# EAGLE design JMP_1_1 (EAGLE 8.3.2)
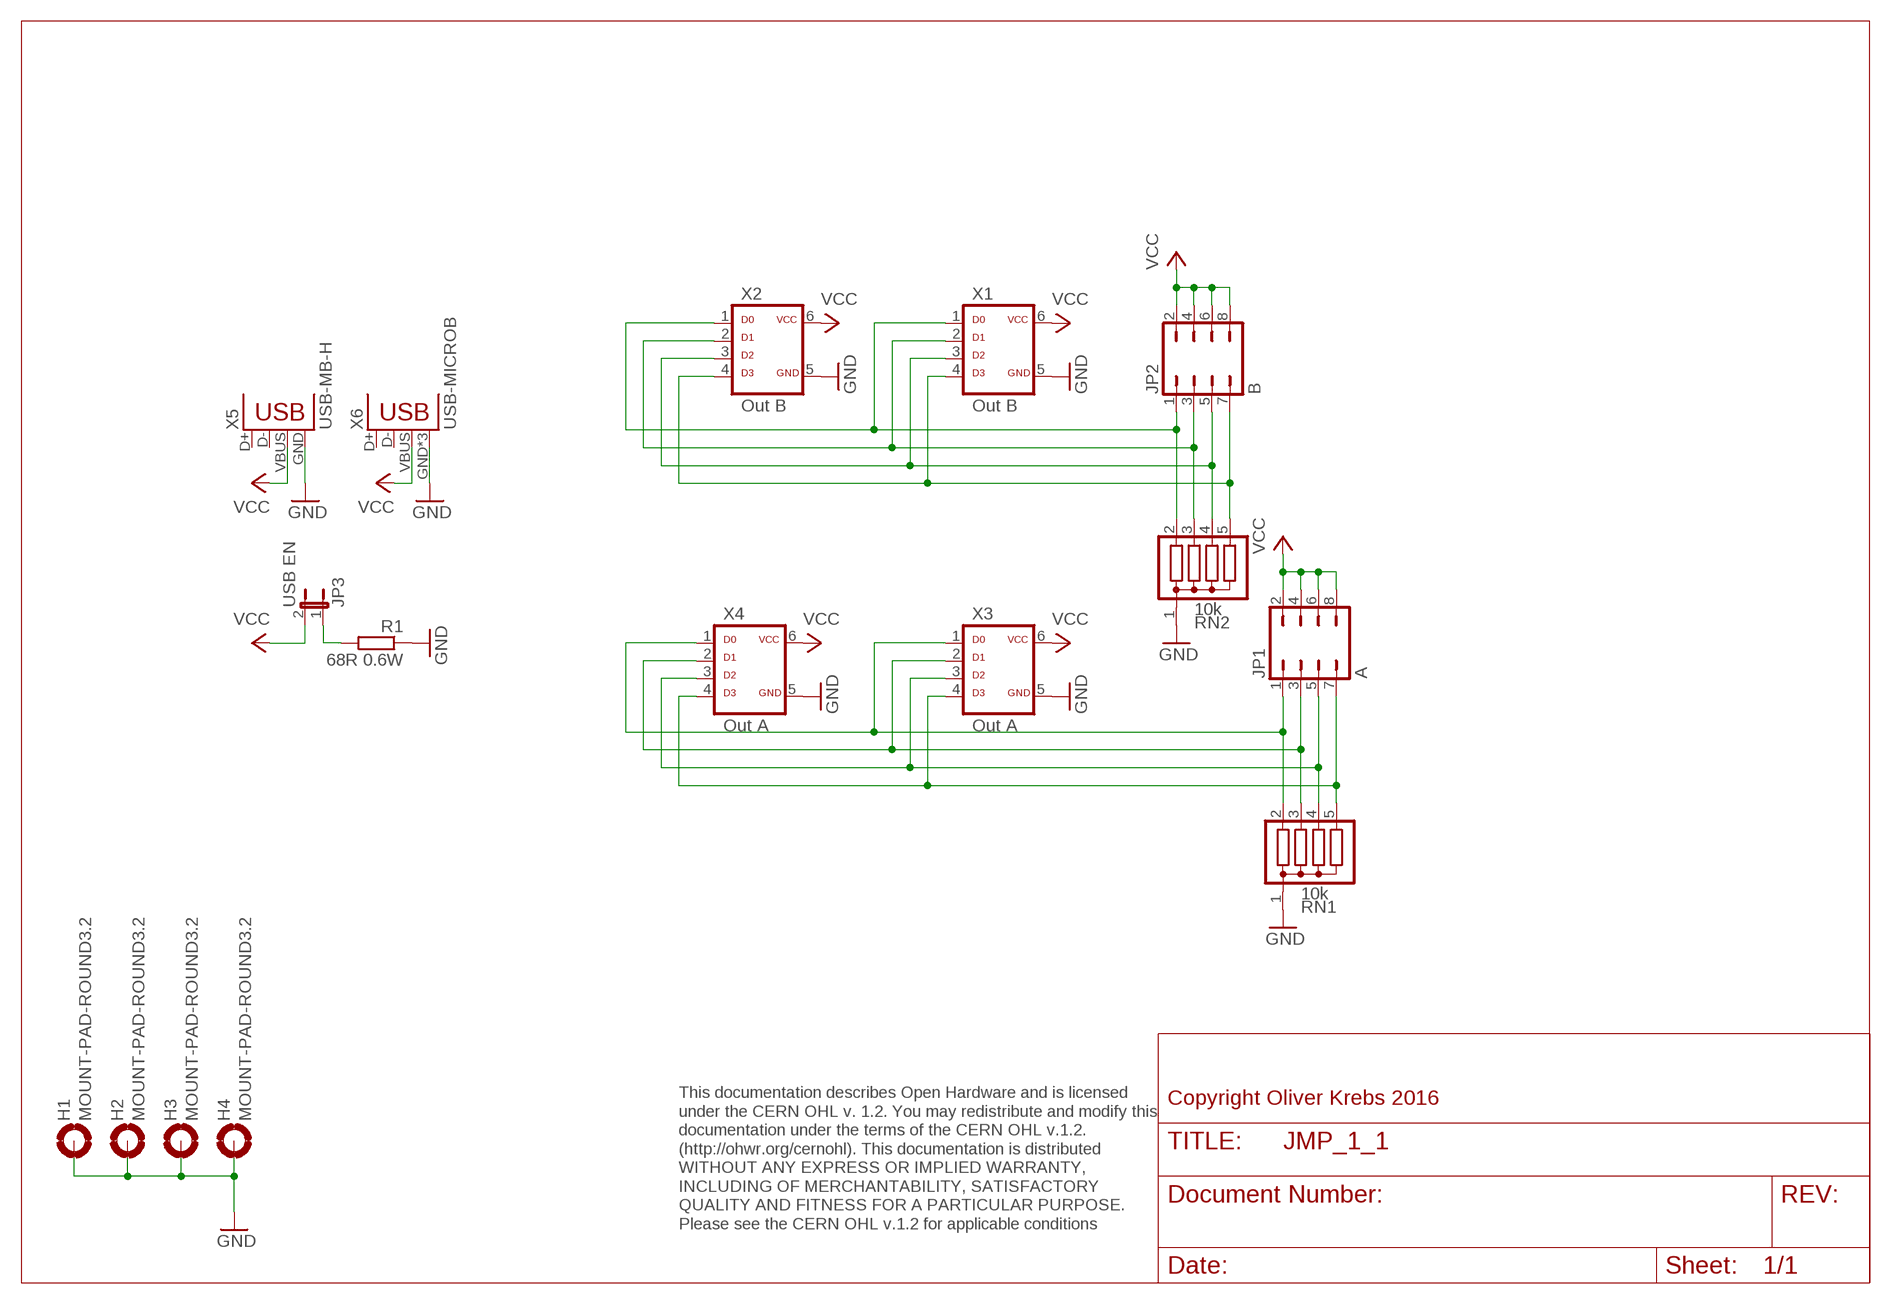
[diagram p0: schematic, sheet 1]

## Parts
H1  MOUNT-PAD-ROUND3.2  [3,2-PAD]
H2  MOUNT-PAD-ROUND3.2  [3,2-PAD]
H3  MOUNT-PAD-ROUND3.2  [3,2-PAD]
H4  MOUNT-PAD-ROUND3.2  [3,2-PAD]
JP1  A  JP4Q  [JP4Q]
JP2  B  JP4Q  [JP4Q]
JP3  USB EN  JP1E  [JP1]
R1  68R 0.6W  R-EU_0207/10  [0207/10]
RN1  10k  G04R  [SIL5]
RN2  10k  G04R  [SIL5]
X1  Out B  ML6D  [ML-6]
X2  Out B  ML6D  [ML-6]
X3  Out A  ML6D  [ML-6]
X4  Out A  ML6D  [ML-6]
X5  USB-MB-H  [USB-MB-H]
X6  USB-MICROB  [USB-MICROB]

## Nets
GND: H1.B3,2(MOUNT) H2.B3,2(MOUNT) H3.B3,2(MOUNT) H4.B3,2(MOUNT) R1.1 RN1.1 RN2.1 X1.5 X2.5 X3.5 X4.5 X5.GND X6.GND X6.MT1(GND) X6.MT2(GND)
N$1: JP2.1 RN2.2 X1.1 X2.1
N$2: JP2.3 RN2.3 X1.2 X2.2
N$3: JP1.1 RN1.2 X3.1 X4.1
N$4: JP2.7 RN2.5 X1.4 X2.4
N$5: JP1.3 RN1.3 X3.2 X4.2
N$6: JP1.7 RN1.5 X3.4 X4.4
N$7: JP2.5 RN2.4 X1.3 X2.3
N$8: JP1.5 RN1.4 X3.3 X4.3
N$10: JP3.1 R1.2
VCC: JP1.2 JP1.4 JP1.6 JP1.8 JP2.2 JP2.4 JP2.6 JP2.8 JP3.2 X1.6 X2.6 X3.6 X4.6 X5.VBUS X6.VBUS
Unconnected: X5.D+ X5.D- X6.D+ X6.D-

## Notes on the sheet
- Copyright Oliver Krebs 2016
- This documentation describes Open Hardware and is licensed 
  under the CERN OHL v. 1.2. You may redistribute and modify this 
  documentation under the terms of the CERN OHL v.1.2. 
  (http://ohwr.org/cernohl). This documentation is distributed
  WITHOUT ANY EXPRESS OR IMPLIED WARRANTY, 
  INCLUDING OF MERCHANTABILITY, SATISFACTORY 
  QUALITY AND FITNESS FOR A PARTICULAR PURPOSE. 
  Please see the CERN OHL v.1.2 for applicable conditions

## Library data of the parts
H1-H4 = holes:MOUNT-PAD-ROUND: MOUNTING PAD, round
JP1 JP2 = 01-my-con:JP4Q
JP3 = jumper:JP1E: JUMPER
R1 = 01-my_rcl:R-EU_: RESISTOR, European symbol
RN1 RN2 = resistor-sil:G04R: SIL RESISTOR; OC_FARNELL: unknown; OC_NEWARK: unknown
X1-X4 = 01-my-con:ML6D
X5 = SparkFun-Connectors:USB: USB Connectors USB-B-PTH is fully proven SKU : PRT-00139/CONN-08278 USB-miniB is fully proven SKU : PRT-00587 USB-A-PCB is untested. USB-A-H is throughly reviewed, but untested. Spark Fun Electronics SKU : PRT-00437 USB-B-SMT is throughly reviewed, but untested. Needs silkscreen touching up. USB-A-S has not been used/tested USB-MB-H has not been used/tested USB-MICROB has been used. CONN-09505
X6 = SparkFun-Connectors:USB: USB Connectors USB-B-PTH is fully proven SKU : PRT-00139/CONN-08278 USB-miniB is fully proven SKU : PRT-00587 USB-A-PCB is untested. USB-A-H is throughly reviewed, but untested. Spark Fun Electronics SKU : PRT-00437 USB-B-SMT is throughly reviewed, but untested. Needs silkscreen touching up. USB-A-S has not been used/tested USB-MB-H has not been used/tested USB-MICROB has been used. CONN-09505; PROD_ID: CONN-09505

## Board
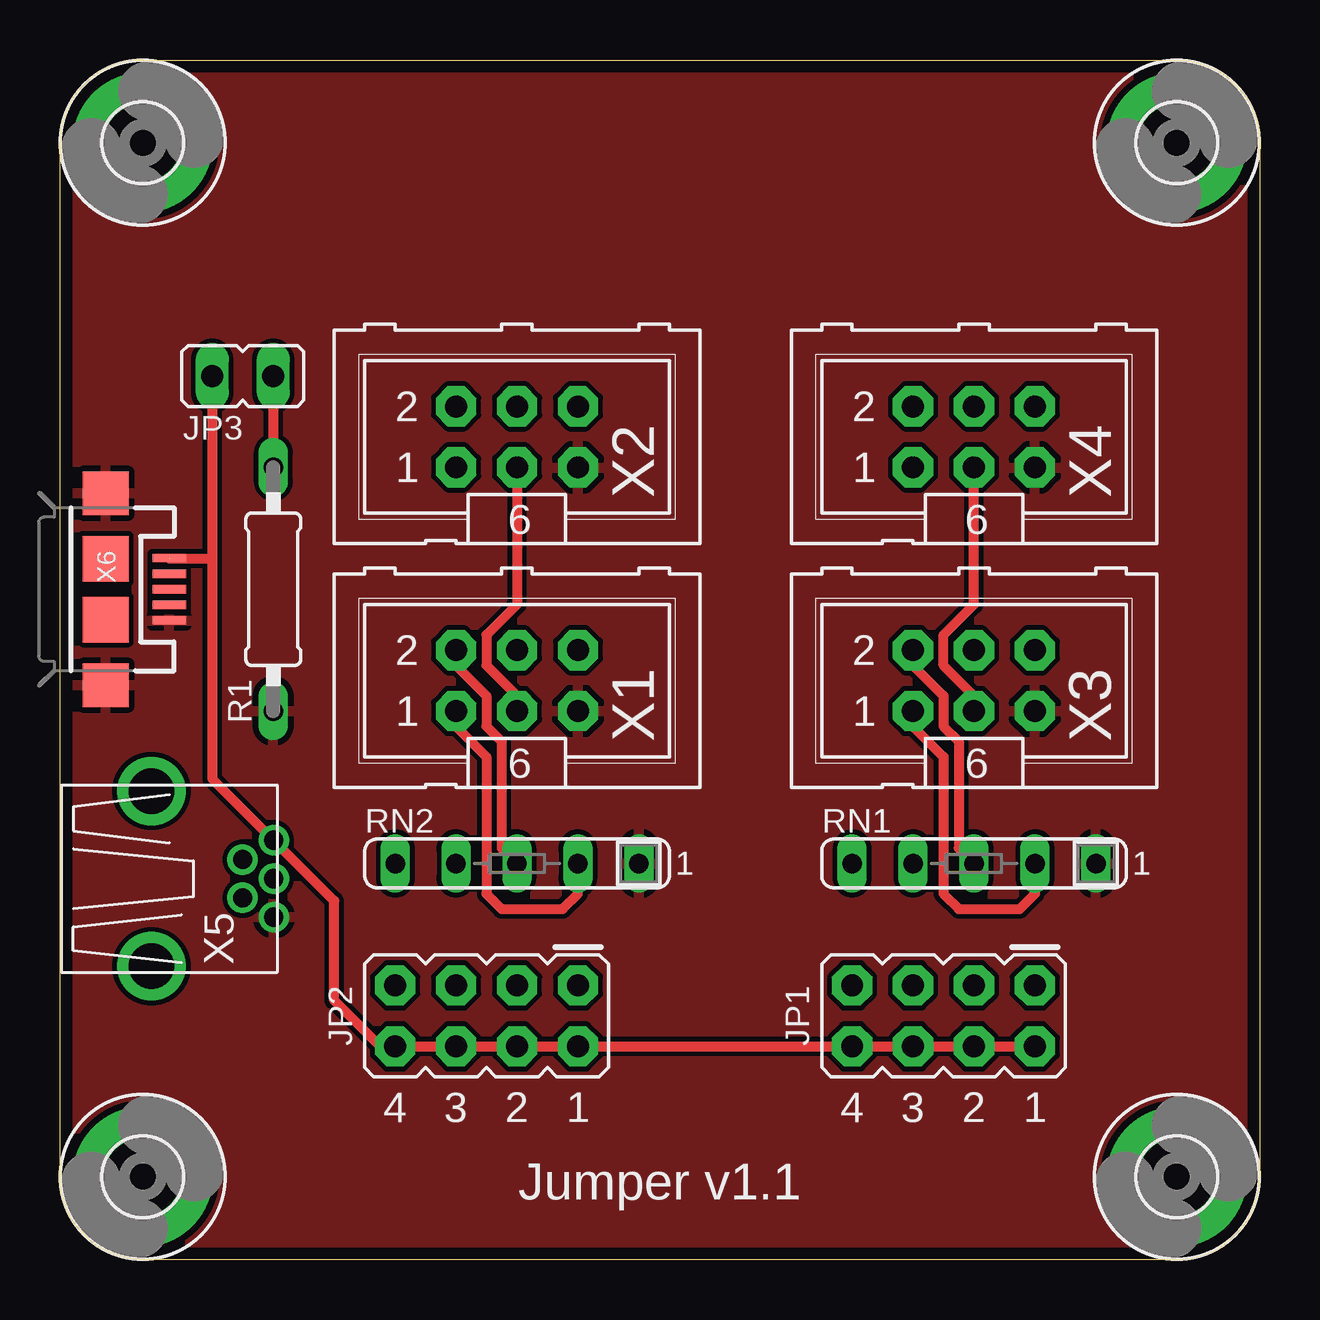
[diagram p1: board, top side]
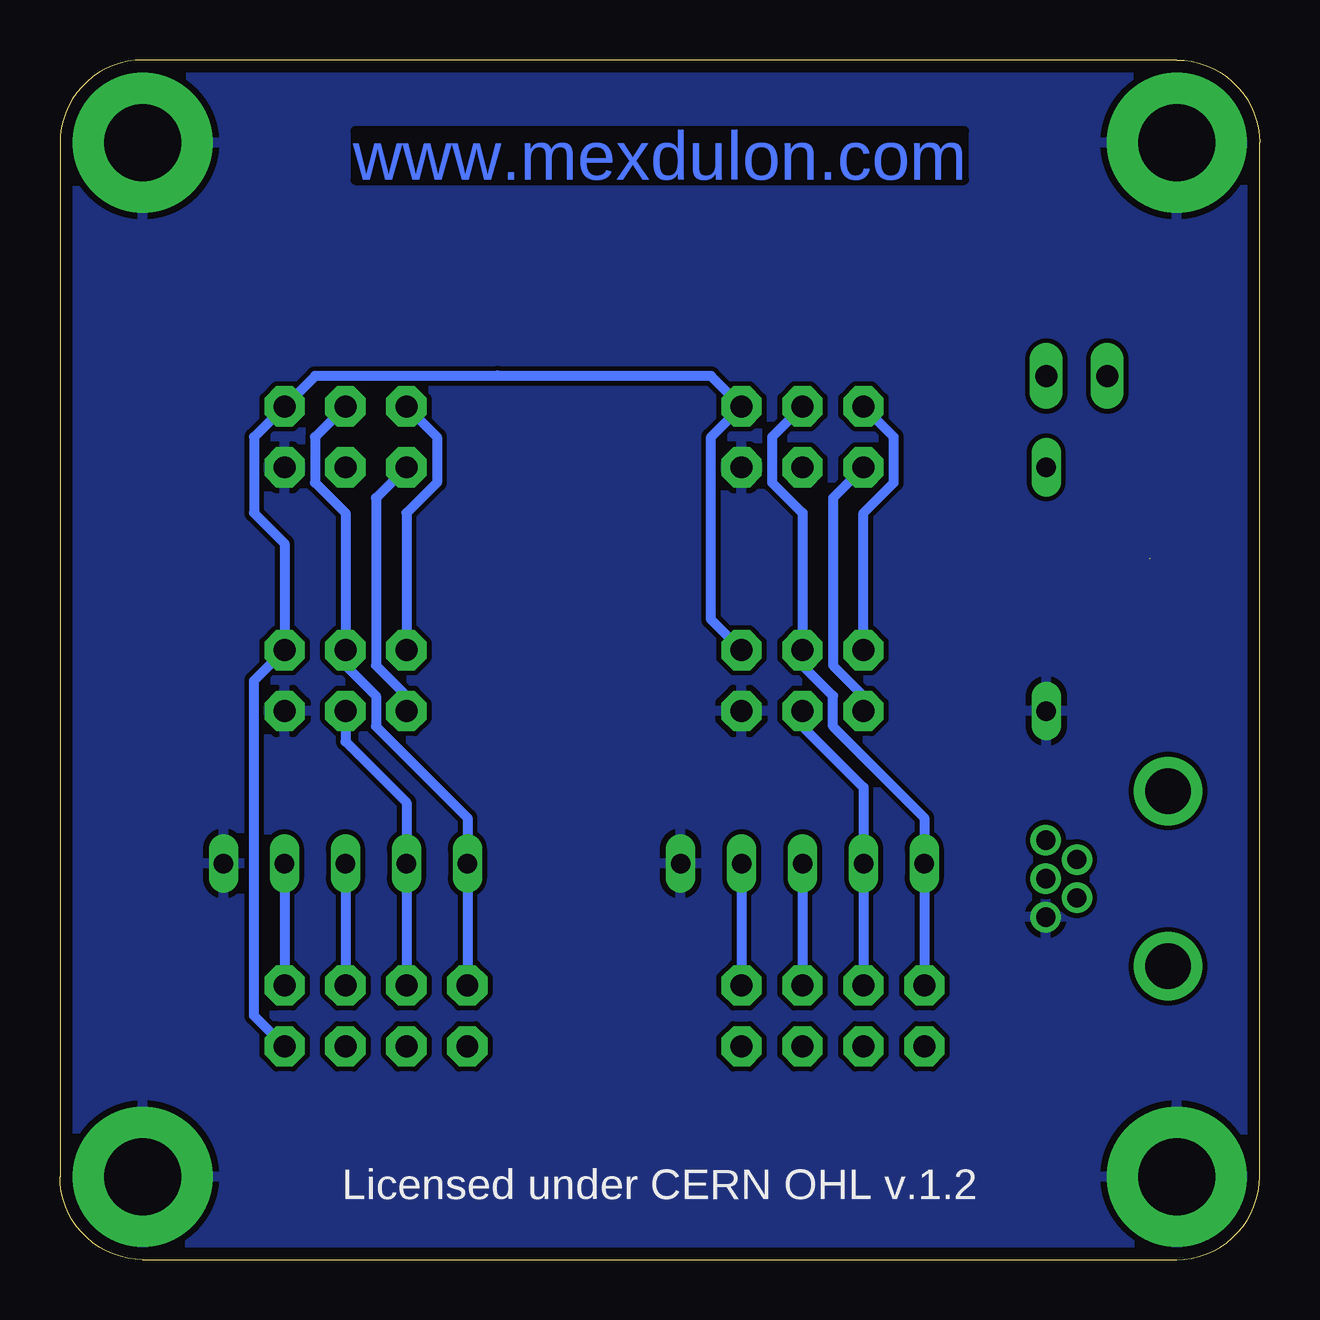
[diagram p2: board, bottom side, seen from below]

Size 50 x 50 mm. Coordinates in mm from the lower left corner, seen from the top.
Outline: 0,3.45 0,46.55 arc-90 3.45,50 46.55,50 arc-90 50,46.55 50,3.45 arc-90 46.55,0 3.45,0 arc-90 0,3.45
Copper layers (1*16): Top 0.035mm / dielectric 1.6mm / Bottom 0.035mm
Design rules "Elecrow_2-layer_PCB_eagle_rule": minimum track width 6mil, minimum drill 12mil, track to track 6mil, track to pad 6mil, pad to pad 6mil, via to via 8mil, smd to smd 0mil, copper to edge 20mil, drill to drill 10mil, minimum pad ring 6mil, minimum via ring 6mil, stop-mask expansion 0mil, vias tented up to drill 100mil, thermal gap 10mil

### Footprints (pad centres in the part's own frame; a part is rotated, then mirrored left to right if it is on the bottom)
3,2-PAD = drill 3.2 pad 5.842: B3,2 0,0
JP4Q = drill 0.914 pad 1.676 octagon: 1 -3.81,-1.27; 2 -3.81,1.27; 3 -1.27,-1.27; 4 -1.27,1.27; 5 1.27,-1.27; 6 1.27,1.27; 7 3.81,-1.27; 8 3.81,1.27
JP1 = drill 0.914 long: 1 0,-1.27; 2 0,1.27
0207/10 = drill 0.813 long: 1 -5.08,0; 2 5.08,0
SIL5 = drill 0.813 long: 1 -5.08,0; 2 -2.54,0; 3 0,0; 4 2.54,0; 5 5.08,0
ML-6 = drill 0.914 pad 1.676 octagon: 1 -2.54,-1.27; 2 -2.54,1.27; 3 0,-1.27; 4 0,1.27; 5 2.54,-1.27; 6 2.54,1.27
USB-MB-H = drill 0.8 pad 1.27: D+ 5.1,0; D- 3.8,0.8; GND 5.1,-1.6; ID 3.8,-0.8; VBUS 5.1,1.6 | drill 1.9: P$6 0,-3.65; P$7 0,3.65
USB-MICROB = smd 0.35 x 1.4: D+ 0,2.65; D- -0.65,2.65; GND 1.3,2.65; ID 0.65,2.65; VBUS -1.3,2.65 | smd 1.8 x 1.9: MT1 -4,0; MT2 4,0 | smd 1.9 x 1.9: P$1 -1.27,0; P$2 1.27,0

### Placement (x,y rotation side)
H1  3.45,3.45 0 top
H2  3.45,46.55 0 top
H3  46.55,46.55 0 top
H4  46.55,3.45 0 top
JP1  36.83,10.16 180 top
JP2  17.78,10.16 180 top
JP3  7.62,36.83 90 top
R1  8.89,27.94 90 top
RN1  38.1,16.51 180 top
RN2  19.05,16.51 180 top
X1  19.05,24.13 0 top
X2  19.05,34.29 0 top
X3  38.1,24.13 0 top
X4  38.1,34.29 0 top
X5  3.81,15.88 0 top
X6  1.91,27.94 270 top

### Tracks (layer width: path | path; a pad name or v marks a point on that pad's centre or on a via)
GND
  pour Bottom (isolate 0.203): 0,0 50.16,0 50.16,50.16 0,50.16
  pour Top (isolate 0.203): 0,50.16 50.16,50.16 50.16,0 0,0
N$1
  Top 0.406: X1.1 16.51,22.23 17.78,20.95 17.78,15.24 18.41,14.61 20.95,14.61 21.59,15.24 RN2.2
  Bottom 0.406: RN2.2 JP2.1 | X2.1 17.78,31.75 17.78,24.77 16.51,23.5 X1.1
N$2
  Top 0.406: X1.2 16.51,24.77 17.78,23.5 17.78,22.23 18.41,21.59 18.41,17.14 RN2.3
  Bottom 0.406: RN2.3 JP2.3 | X1.2 16.51,31.11 15.24,32.38 15.24,34.29 X2.2
N$3
  Top 0.406: X3.1 35.56,22.23 36.83,20.95 36.83,15.24 37.47,14.61 40.01,14.61 40.64,15.24 RN1.2
  Bottom 0.406: RN1.2 JP1.1 | X4.1 36.83,31.75 36.83,24.77 35.56,23.5 X3.1
N$4
  Bottom 0.406: JP2.7 RN2.5 13.97,18.41 17.78,22.23 17.78,23.5 19.05,24.77 X1.4 19.05,31.11 20.32,32.38 20.32,34.29 X2.4
N$5
  Top 0.406: X3.2 35.56,24.77 36.83,23.5 36.83,22.23 37.47,21.59 37.47,17.14 RN1.3
  Bottom 0.406: RN1.3 JP1.3 | X4.2 34.29,34.29 34.29,32.38 35.56,31.11 X3.2
N$6
  Bottom 0.406: JP1.7 RN1.5 33.02,18.41 36.83,22.23 36.83,23.5 38.1,24.77 X3.4 38.1,31.11 39.37,32.38 39.37,34.29 X4.4
N$7
  Top 0.406: X2.3 19.05,27.3 17.78,26.04 17.78,24.77 19.05,23.5 X1.3
  Bottom 0.406: JP2.5 RN2.4 16.51,19.68 19.05,22.23 X1.3
N$8
  Top 0.406: X3.3 38.1,23.5 36.83,24.77 36.83,26.04 38.1,27.3 X4.3
  Bottom 0.406: JP1.5 RN1.4 35.56,19.05 38.1,21.59 X3.3
N$10
  Top 0.406: JP3.1 R1.2
VCC  (1 unrouted)
  Top 0.406: JP1.2 JP1.4 JP1.6 JP1.8 JP2.2 JP2.4 JP2.6 JP2.8 13.34,8.89 11.43,10.79 11.43,14.96 X5.VBUS 6.35,20.04 6.35,29.21 | JP3.2 6.35,29.21 | 4.58,29.21 6.35,29.21
  Bottom 0.406: 31.75,36.83 22.86,36.83 X2.6 22.86,34.29 22.86,26.67 X1.6 | 31.75,36.83 39.37,36.83 X4.6 41.91,34.29 41.91,31.11 40.64,29.84 X3.6 41.91,24.13 41.91,10.16 JP1.2 | 31.77,36.85 31.75,36.83

### Text on the board
Bottom: www.mexdulon.com | www.mexdulon.com
tNames: 4 | 3 | 2 | 1 | 4 | 3 | 2 | 1 | Jumper v1.1
bNames: Licensed under CERN OHL v.1.2